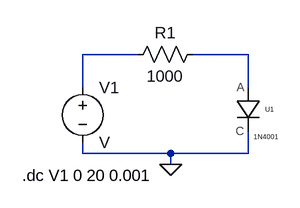
[diagram p0: schematic diode_app.asc]
diode_app.asc, the LTspice schematic file:
Version 4
SHEET 1 880 680
WIRE 160 80 80 80
WIRE 320 80 240 80
WIRE 80 128 80 80
WIRE 320 128 320 80
WIRE 80 224 80 208
WIRE 208 224 80 224
WIRE 320 224 320 192
WIRE 320 224 208 224
WIRE 208 240 208 224
FLAG 208 240 0
SYMBOL voltage 80 112 R0
SYMATTR InstName V1
SYMBOL res 256 64 R90
WINDOW 0 0 56 VBottom 2
WINDOW 3 32 56 VTop 2
SYMATTR InstName R1
SYMATTR Value 1000
SYMBOL advee_components\\1N4001 304 128 R0
SYMATTR InstName U1
TEXT -8 256 Left 2 !.dc V1 0 20 0.001

The netlist it stands for:
* diode_app.asc
V1 N001 0 V
R1 N002 N001 1000
XU1 N002 0 1N4001  ; pins A C
.dc V1 0 20 0.001
.lib AdvEE_Components.lib
.backanno
.end